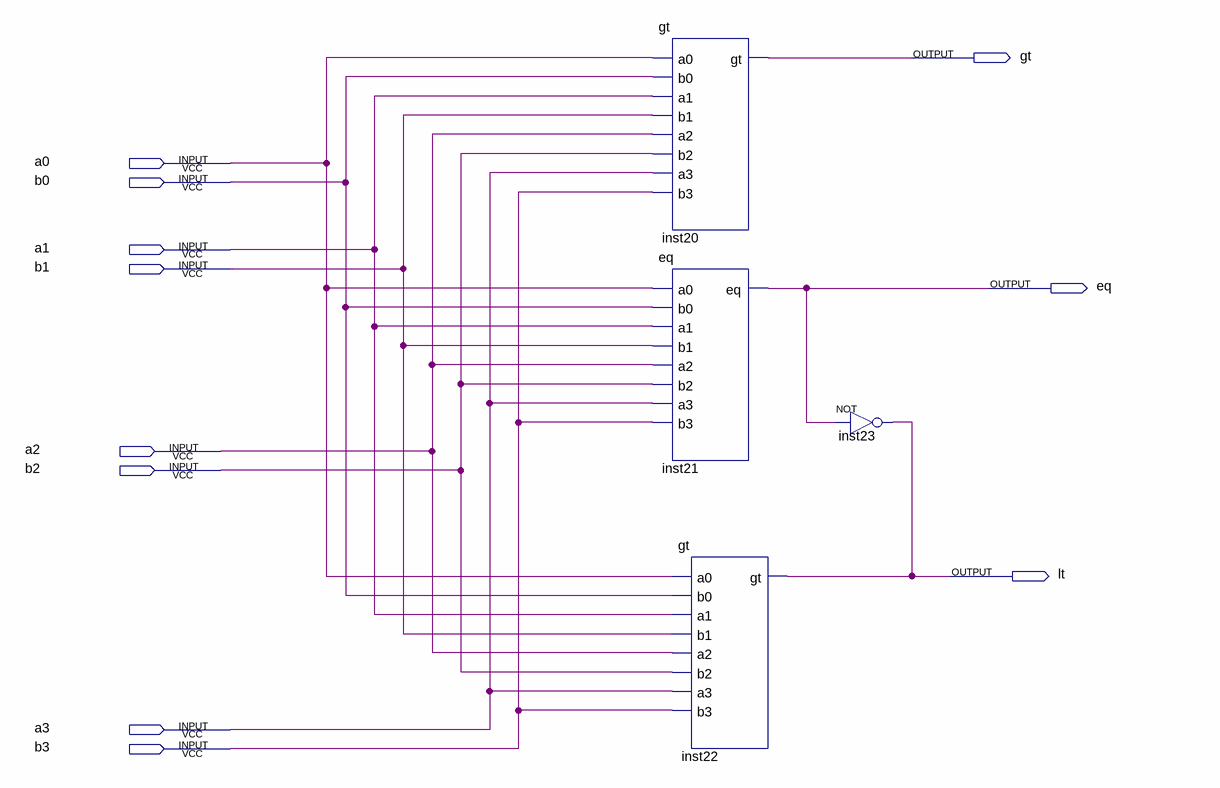
[diagram p0: schematic sheet]
// Quartus schematic comp4.bdf as structural Verilog: 4 symbols, 11 pins
module comp4 (
  input  a0,
  input  b0,
  input  a1,
  input  b1,
  input  a2,
  input  b2,
  input  a3,
  input  b3,
  output gt,
  output eq,
  output lt
);

  gt inst20 (.a0(a0), .b0(b0), .a1(a1), .b1(b1), .a2(a2), .b2(b2), .a3(a3), .b3(b3), .gt(gt));
  eq inst21 (.a0(a0), .b0(b0), .a1(a1), .b1(b1), .a2(a2), .b2(b2), .a3(a3), .b3(b3), .eq(eq));
  gt inst22 (.a0(a0), .b0(b0), .a1(a1), .b1(b1), .a2(a2), .b2(b2), .a3(a3), .b3(b3), .gt(lt));
  not inst23 (lt, eq);
endmodule
